# EasyEDA schematic SCH_USB-Hub-with-audio-card_2025-04-09.json
TITLE: USB Hub; REV: 1.0; Date: 2025-03-29; Sheet: 1/1; Drawn By: Hasnat; Company: Hasnat4763
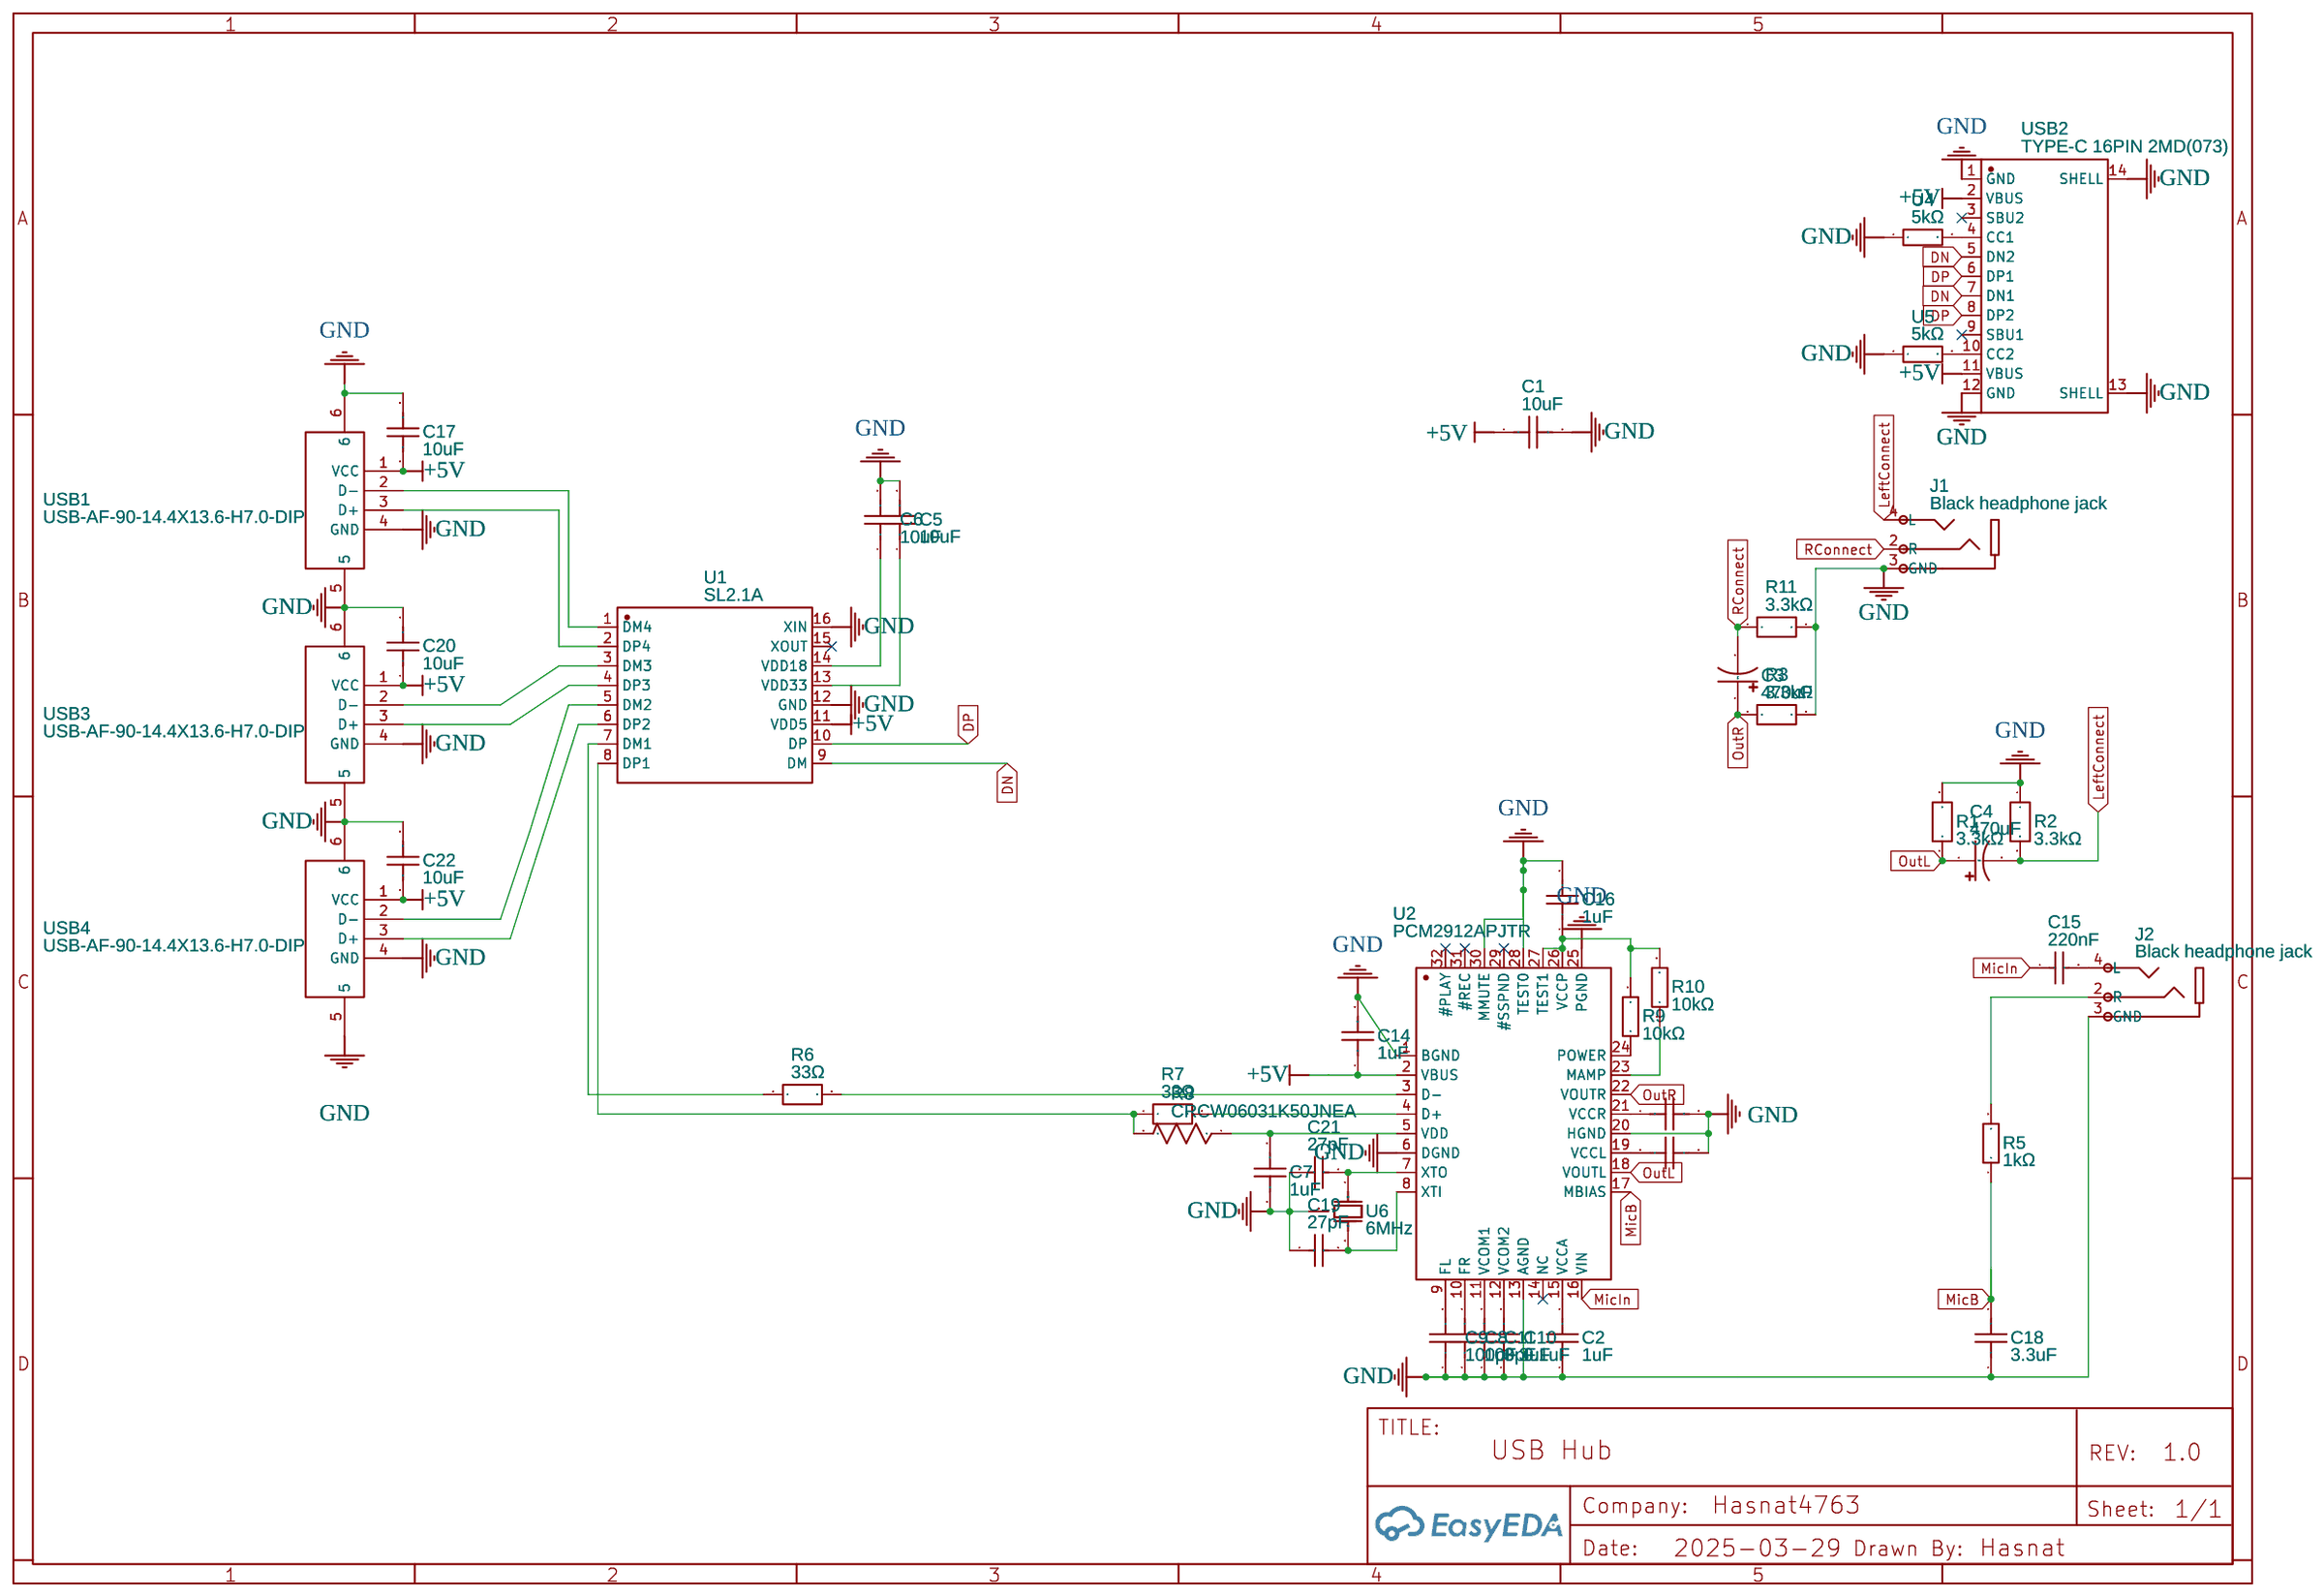
[diagram p0: schematic sheet]

## Parts
C1  10uF  [C0603]
C2  1uF  [C0603]
C3  470uF  [CAP-TH_BD8.0-P3.50-D0.6-FD]
C4  470uF  [CAP-TH_BD8.0-P3.50-D0.6-FD]
C5  10uF  [C0603]
C6  10uF  [C0603]
C7  1uF  [C1206]
C8  100pF  [C0603]
C9  100pF  [C0603]
C10  0.1uF  [C0603]
C11  3.3uF  [C0603]
C12  1uF  [C1206]
C13  1uF  [C1206]
C14  1uF  [C0603]
C15  220nF  [C0402]
C16  1uF  [C1206]
C17  10uF  [C0603]
C18  3.3uF  [CAP-TH_L7.5-W4.5-P5.00-D0.5]
C19  27pF  [C0805]
C20  10uF  [C0603]
C21  27pF  [C0805]
C22  10uF  [C0603]
J1  Black headphone jack  [AUDIO-TH_PJ-3200]
J2  Black headphone jack  [AUDIO-TH_PJ-3200]
R1  3.3kΩ  [R0805]
R2  3.3kΩ  [R0805]
R3  3.3kΩ  [R0805]
R5  1kΩ  [R0603]
R6  33Ω  [R0603]
R7  33Ω  [R0603]
R8  CRCW06031K50JNEA  [RESC1608X60N]
R9  10kΩ  [R0603]
R10  10kΩ  [R0603]
R11  3.3kΩ  [R0805]
U1  SL2.1A  [SOP-16_L10.0-W3.9-P1.27-LS6.0-BL]
U2  PCM2912APJTR  [TQFP-32_L7.0-W7.0-P0.80-LS9.0-TL]
U4  5kΩ  [RES-TH_BD3.3-L9.0-P13.00-D0.6]
U5  5kΩ  [RES-TH_BD3.3-L9.0-P13.00-D0.6]
U6  6MHz  [HC-49US-3_L11.4-W4.7]
USB1  USB-AF-90-14.4X13.6-H7.0-DIP  [USB-A-TH_C46407]
USB2  TYPE-C 16PIN 2MD(073)  [USB-C-SMD_TYPE-C-6PIN-2MD-073]
USB3  USB-AF-90-14.4X13.6-H7.0-DIP  [USB-A-TH_C46407]
USB4  USB-AF-90-14.4X13.6-H7.0-DIP  [USB-A-TH_C46407]

## Library data of the parts
C1 C5 C6 C17 C20 C22 = CL10A106KP8NNNC: Supplier: LCSC; Manufacturer: SAMSUNG(三星); Supplier Part: C19702
C2 C14 = CGB3B1X7R1A105K055AC: Contributor: lcsc; Supplier: LCSC; Supplier Part: C3844656; Manufacturer: TDK
C3 C4 = UKW1C471MPD: Contributor: LCSC; Supplier: LCSC; Supplier Part: C250974; Manufacturer: Nichicon(尼吉康); JLCPCB Part Class: Extended Part
C7 C12 C13 C16 = CL31B105KBHNNNE: Supplier: LCSC; Manufacturer: SAMSUNG(三星); Supplier Part: C1848; JLCPCB Part Class: Basic Part
C8-C11 = CL10A106KP8NNNC: Supplier: LCSC; Manufacturer: SAMSUNG(三星); Supplier Part: C19702; Package Display: No
C15 = CL05A224KA5NNNC: Supplier: LCSC; Manufacturer: SAMSUNG(三星); Supplier Part: C47129; JLCPCB Part Class: Extended Part
C18 = KVD500L335M55A0T00: Contributor: LCSC; Supplier: LCSC; Supplier Part: C1622382; Manufacturer: NCC(日本贵弥功); JLCPCB Part Class: Extended Part
C19 C21 = CC0805JRNPO9BN270: Supplier: LCSC; Manufacturer: YAGEO(国巨); Supplier Part: C107113; JLCPCB Part Class: Extended Part
J1 J2 = Black headphone jack: Supplier: LCSC; Manufacturer: BOOMELE(博穆精密); Manufacturer Part: 320B直插; Supplier Part: C18166; JLCPCB Part Class: Extended Part
R1-R3 R11 = CR-05JL7---3K3: Contributor: LCSC; Supplier: LCSC; Supplier Part: C416149; Manufacturer: Viking(光颉); JLCPCB Part Class: Extended Part
R5 = RT0603DRD071KL: Contributor: LCSC; Supplier: LCSC; Supplier Part: C165964; Manufacturer: YAGEO(国巨)
R6 R7 = CRCW060333R0JNEA: Contributor: LCSC; Supplier: LCSC; Supplier Part: C844156; Manufacturer: VISHAY(威世); JLCPCB Part Class: Extended Part
R8 = CRCW06031K50JNEA: RESISTOR, 0603
R9 R10 = CRCW060310K0JNEA: Contributor: LCSC; Supplier: LCSC; Supplier Part: C169103; Manufacturer: VISHAY(威世); JLCPCB Part Class: Extended Part
U1 = SL2.1A: Contributor: LCSC; Supplier: LCSC; Supplier Part: C192893; Manufacturer: CoreChips(和芯润德); JLCPCB Part Class: Extended Part
U2 = PCM2912APJTR: Contributor: LCSC; Supplier: LCSC; Supplier Part: C475497; Manufacturer: TI(德州仪器); JLCPCB Part Class: Extended Part
U4 U5 = MFP1WSBRD52-5K: Contributor: lcsc; Supplier: LCSC; Supplier Part: C1782380; Manufacturer: YAGEO(国巨)
U6 = ECS-60-18-5G3X-JGN-TR: Contributor: lcsc; Supplier: LCSC; Supplier Part: C2449832; Manufacturer: ECS; JLCPCB Part Class: Extended Part
USB1 USB3 USB4 = USB-AF-90-14.4X13.6-H7.0-DIP: Contributor: LCSC; Supplier: LCSC; Supplier Part: C46407; Manufacturer: 精拓金; Manufacturer Part: 903-131A1011D10100; JLCPCB Part Class: Extended Part
USB2 = TYPE-C 16PIN 2MD(073): Contributor: LCSC; Supplier: LCSC; Supplier Part: C2765186; Manufacturer: SHOU HAN(首韩); JLCPCB Part Class: Extended Part

## Nets
+5V: C1.1 C14.1 C17.1 C20.1 C22.1 U1.11(VDD5) U2.2(VBUS) USB1.1(VCC) USB2.2(VBUS) USB2.11(VBUS) USB3.1(VCC) USB4.1(VCC)
GND: C1.2 C2.1 C5.2 C6.2 C7.1 C8.1 C9.1 C10.1 C11.1 C12.2 C13.2 C14.2 C16.2 C17.2 C18.1 C19.1 C20.2 C21.1 C22.2 J1.3(GND) J2.3(GND) R1.2 R2.1 R3.2 R11.2 U1.12(GND) U1.16(XIN) U2.1(BGND) U2.6(DGND) U2.13(AGND) U2.20(HGND) U2.25(PGND) U2.28(TEST0) U2.30(MMUTE) U4.1 U5.1 U6.3(GND) USB1.4(GND) USB1.5 USB1.6 USB2.1(GND) USB2.12(GND) USB2.13(SHELL) USB2.14(SHELL) USB3.4(GND) USB3.5 USB3.6 USB4.4(GND) USB4.5 USB4.6
DN: U1.9(DM) USB2.5(DN2) USB2.7(DN1)
DP: U1.10(DP) USB2.6(DP1) USB2.8(DP2)
LeftConnect: C4.2 J1.4(L) R2.2
MicB: C18.2 R5.1 U2.17(MBIAS)
MicIn: C15.1 U2.16(VIN)
OutL: C4.1 R1.1 U2.18(VOUTL)
OutR: C3.1 R3.1 U2.22(VOUTR)
RConnect: C3.2 J1.2(R) R11.1
Net-(C2-2): C2.2 U2.15(VCCA)
Net-(C5-1): C5.1 U1.13(VDD33)
Net-(C6-1): C6.1 U1.14(VDD18)
Net-(C7-2): C7.2 R8.1 U2.5(VDD)
Net-(C8-2): C8.2 U2.10(FR)
Net-(C9-2): C9.2 U2.9(FL)
Net-(C10-2): C10.2 U2.12(VCOM2)
Net-(C11-2): C11.2 U2.11(VCOM1)
Net-(C12-1): C12.1 U2.21(VCCR)
Net-(C13-1): C13.1 U2.19(VCCL)
Net-(C15-2): C15.2 J2.4(L)
Net-(C16-1): C16.1 R9.2 R10.2 U2.26(VCCP) U2.27(TEST1)
Net-(C19-2): C19.2 U2.8(XTI) U6.2(Out/In)
Net-(C21-2): C21.2 U2.7(XTO) U6.1(In/Out)
Net-(J2-2): J2.2(R) R5.2
Net-(R6-1): R6.1 U1.7(DM1)
Net-(R6-2): R6.2 U2.3(D-)
Net-(R7-1): R7.1 R8.2 U1.8(DP1)
Net-(R7-2): R7.2 U2.4(D+)
Net-(R9-1): R9.1 U2.24(POWER)
Net-(R10-1): R10.1 U2.23(MAMP)
Net-(U1-1): U1.1(DM4) USB1.2(D-)
Net-(U1-2): U1.2(DP4) USB1.3(D+)
Net-(U1-3): U1.3(DM3) USB3.2(D-)
Net-(U1-4): U1.4(DP3) USB3.3(D+)
Net-(U1-5): U1.5(DM2) USB4.2(D-)
Net-(U1-6): U1.6(DP2) USB4.3(D+)
Net-(U4-2): U4.2 USB2.4(CC1)
Net-(U5-2): U5.2 USB2.10(CC2)

Not connected (* = marked no-connect by the designer): U1 15(XOUT)*; U2 14(NC)* 29(#SSPND)* 31(#REC)* 32(#PLAY)*; USB2 3(SBU2)* 9(SBU1)*
